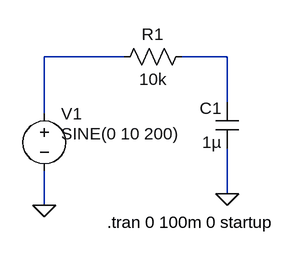
[diagram p0: schematic capacitive_reactance.asc]
capacitive_reactance.asc, the LTspice schematic file:
Version 4
SHEET 1 880 680
WIRE 192 16 80 16
WIRE 336 16 272 16
WIRE 336 80 336 16
WIRE 80 96 80 16
WIRE 336 208 336 144
WIRE 80 224 80 176
FLAG 80 224 0
FLAG 336 208 0
SYMBOL voltage 80 80 R0
WINDOW 123 24 124 Left 2
WINDOW 39 0 0 Left 0
WINDOW 3 24 44 Left 2
SYMATTR InstName V1
SYMATTR Value SINE(0 10 200)
SYMBOL res 288 0 R90
WINDOW 0 0 56 VBottom 2
WINDOW 3 32 56 VTop 2
SYMATTR InstName R1
SYMATTR Value 10k
SYMBOL cap 352 144 R180
WINDOW 0 24 56 Left 2
WINDOW 3 24 8 Left 2
SYMATTR InstName C1
SYMATTR Value 1µ
TEXT 168 248 Left 2 !.tran 0 100m 0 startup

The netlist it stands for:
* capacitive_reactance.asc
V1 N001 0 SINE(0 10 200)
R1 N002 N001 10k
C1 0 N002 1µ
.tran 0 100m 0 startup
.backanno
.end